# EAGLE schematic ledboard (EAGLE 6.5.0)
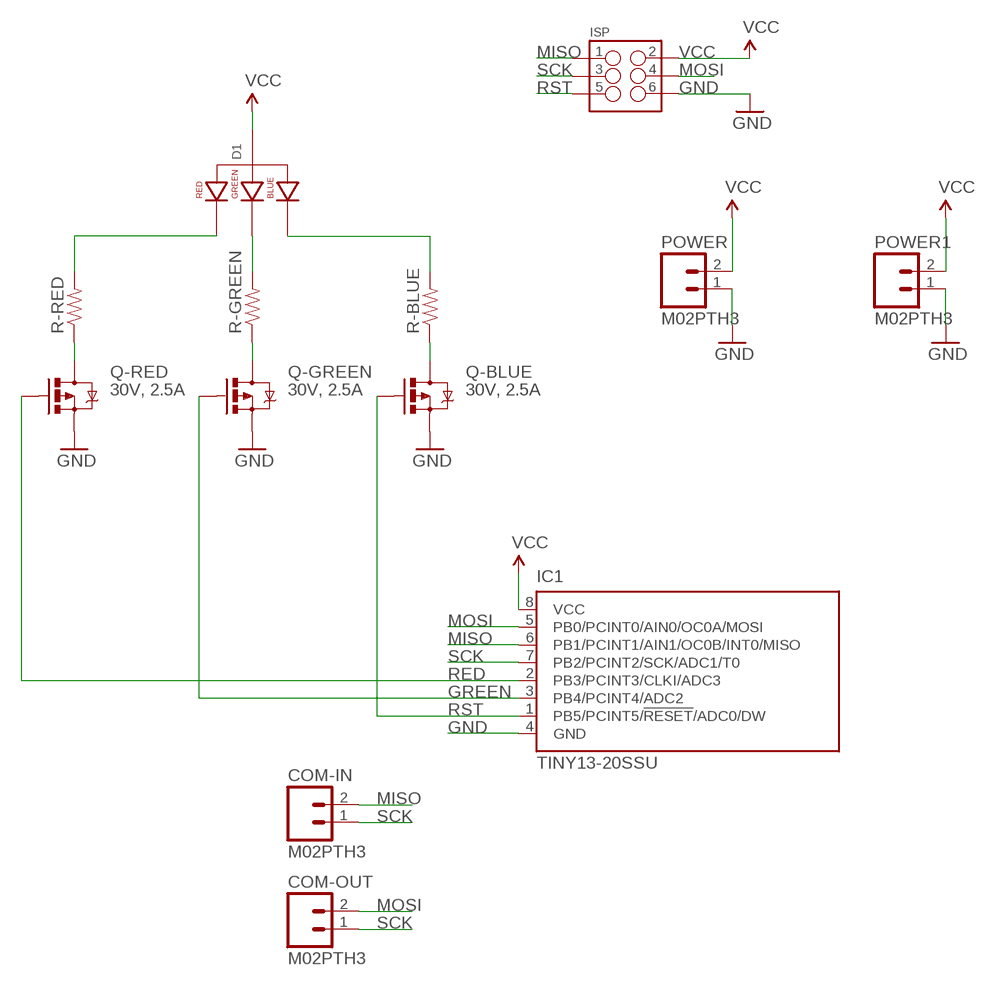
[diagram p0: schematic, sheet 1]

## Parts
COM-IN  M02PTH3  [1X02_LONGPADS]
COM-OUT  M02PTH3  [1X02_LONGPADS]
D1  LED-RGB-CA-THRUCLEAR  [LED-RGB-THRU]
IC1  TINY13-20SSU  [8S1]
ISP  M03X22X3_SILK_SM  [2X3]
POWER  M02PTH3  [1X02_LONGPADS]
POWER1  M02PTH3  [1X02_LONGPADS]
Q-BLUE  30V, 2.5A  MOSFET-PCHANNELDMG2307L  [SOT23-3]
Q-GREEN  30V, 2.5A  MOSFET-PCHANNELDMG2307L  [SOT23-3]
Q-RED  30V, 2.5A  MOSFET-PCHANNELDMG2307L  [SOT23-3]
R-BLUE  RESISTOR0603  [0603-RES]
R-GREEN  RESISTOR0603  [0603-RES]
R-RED  RESISTOR0603  [0603-RES]

## Nets
GND: IC1.4(GND) ISP.6 POWER1.1 POWER.1 Q-BLUE.2(S) Q-GREEN.2(S) Q-RED.2(S)
GREEN: IC1.3(PB4/PCINT4/ADC2) Q-GREEN.1(G)
MISO: COM-IN.2 IC1.6(PB1/PCINT1/AIN1/OC0B/INT0/MISO) ISP.1
MOSI: COM-OUT.2 IC1.5(PB0/PCINT0/AIN0/OC0A/MOSI) ISP.4
N$1: D1.1(RED_CATHODE) R-RED.2
N$2: Q-RED.3(D) R-RED.1
N$3: D1.4(BLUE_CATHODE) R-BLUE.2
N$4: D1.3(GREEN_CATHODE) R-GREEN.2
N$5: Q-GREEN.3(D) R-GREEN.1
N$6: Q-BLUE.3(D) R-BLUE.1
RED: IC1.2(PB3/PCINT3/CLKI/ADC3) Q-RED.1(G)
RST: IC1.1(PB5/PCINT5/!RESET!/ADC0/DW) ISP.5 Q-BLUE.1(G)
SCK: COM-IN.1 COM-OUT.1 IC1.7(PB2/PCINT2/SCK/ADC1/T0) ISP.3
VCC: D1.2(ANODE) IC1.8(VCC) ISP.2 POWER1.2 POWER.2

## Library data of the parts
COM-IN COM-OUT POWER POWER1 = SparkFun-Connectors:M02: Standard 2-pin 0.1" header. Use with - straight break away headers ( PRT-00116) - right angle break away headers (PRT-00553) - swiss pins (PRT-00743) - machine pins (PRT-00117) - female headers (PRT-00115) Molex polarized connector foot print use with: PRT-08233 with associated crimp pins and housings. 2.54_SCREWTERM for use with PRT-10571. 3.5mm Screw Terminal footprints for PRT-08084 5mm Screw Terminal footprints for use with PRT-08433
D1 = SparkFun-LED:LED-RGB-CA-THRU: RGB Through-hole common anode SparkFun store front COM-10821 (diffuse) COM-10820 (clear); PROD_ID: DIO-10631
IC1 = atmel:TINY13: 8-bit AVR Microcontroller with 1K Bytes In-System Programmable Flash Source: http://www.atmel.com/dyn/resources/prod_documents/2535S.pdf; MPN: ATTINY13-20SSU; OC_FARNELL: 1455133; OC_NEWARK: 58M3771
ISP = SparkFun-Connectors:M03X2: 2x3 .1" header. Shrouded, with keying- CONN-10681 SMT- CONN-11415 Pogo pins- HW-11044
Q-BLUE Q-GREEN Q-RED = SparkFun-DiscreteSemi:MOSFET-PCHANNEL: Generic PMOSFET IRLML2244 - TRANS-11153 (SOT-23 -20V -4.3A) (1.Gate 2.Source 3.Drain) FQP27P06 - COM-10349 <http://www.sparkfun.com/products/10349> (TO-220 -60V -27A) (1.Gate 2.Source 3.Drain); PROD_ID: TRANS-11308
R-BLUE R-GREEN R-RED = SparkFun-Resistors:RESISTOR: Resistor Basic schematic elements and footprints for 0603, 1206, and PTH resistors.